# Altium schematic sheet QSFP.SchDoc: QSFP
size 420 x 297 mm; Author: G.K.; CompanyName: WUT; DrawnBy: G.K.; Organization: CERN; Address1: Warsaw Univeristy of Technology; Address2: Nowowiejska 15/19; DocumentNumber: 7; Revision: -; SheetNumber: 7; SheetTotal: -; EDA_Number: ARTIQ; Projet: RTM 4SFP 3QSFP; ModifiedBy: -; CreateDate: XX/XX/XXXX; CheckedDate: -; Title2: and I2C control; DivGrp: ISE; Designer: G.K.; ModifiedDate: -; ProjectName: RTM 4SFP 3QSFP
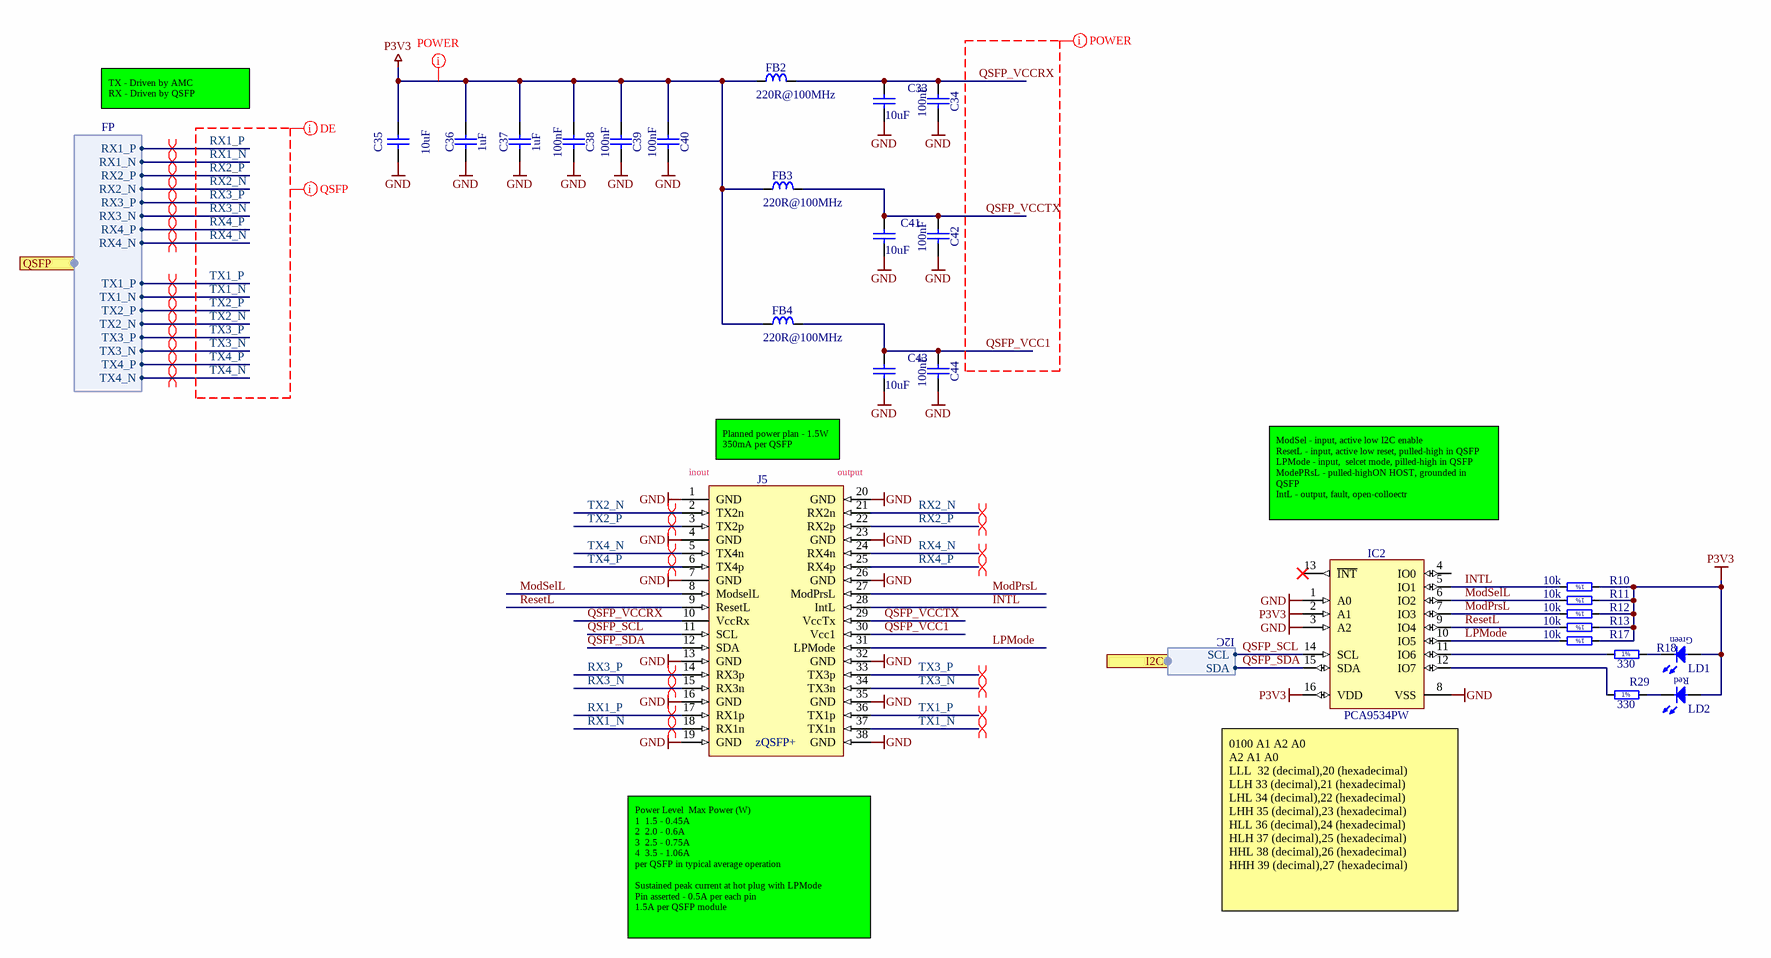
[diagram p0: QSFP.SchDoc]

## Parts
C33  10uF  [CAPC2012X135N]
C34  100nF  [CAPC0603X33N]
C35  10uF  [CAPC2012X135N]
C36  1uF  [CAPC1608X87N]
C37  1uF  [CAPC1608X87N]
C38  100nF  [CAPC0603X33N]
C39  100nF  [CAPC0603X33N]
C40  100nF  [CAPC0603X33N]
C41  10uF  [CAPC2012X135N]
C42  100nF  [CAPC0603X33N]
C43  10uF  [CAPC2012X135N]
C44  100nF  [CAPC0603X33N]
FB2  220R@100MHz  [INDC2012X105N]
FB3  220R@100MHz  [INDC2012X105N]
FB4  220R@100MHz  [INDC2012X105N]
IC2  PCA9534PW  [SOP65P640X110-16N]
J5  zQSFP+  [TYCO_1551920-2]
LD1  LED_AVAGO_HSME-C120  [LED_AVAGO_HSME-C120]  (value not drawn)
LD2  Red  [LED_AVAGO_HSME-C120rev]  (value not drawn)
R10  10k  [RESC1005X40N]
R11  10k  [RESC1005X40N]
R12  10k  [RESC1005X40N]
R13  10k  [RESC1005X40N]
R17  10k  [RESC1005X40N]
R18  330  [RESC1608X55N]
R29  330  [RESC1608X55N]

## Ports
I2C (harness I2C), QSFP (harness FP)

## Harnesses
FP: RX1_P, RX1_N, RX2_N, RX2_P, TX1_P, TX1_N, TX2_N, TX2_P, RX3_P, RX3_N, RX4_N, RX4_P, TX3_P, TX3_N, TX4_N, TX4_P
I2C: SCL, SDA

## Nets
GND: C33.2 C34.2 C35.2 C36.1 C37.1 C38.2 C39.2 C40.2 C41.2 C42.2 C43.2 C44.2 IC2.1(A0) IC2.3(A2) IC2.8(VSS) J5.1(GND) J5.4(GND) J5.7(GND) J5.13(GND) J5.16(GND) J5.19(GND) J5.20(GND) J5.23(GND) J5.26(GND) J5.32(GND) J5.35(GND) J5.38(GND)
P3V3: C35.1 C36.2 C37.2 C38.1 C39.1 C40.1 FB2.1 FB3.1 FB4.1 IC2.2(A1) IC2.16(VDD) LD1.2(A) LD2.1(A) R10.1 R11.1 R12.1 R13.1 R17.1
INTL: IC2.5(IO1) J5.28(IntL) R10.2
LPMode: IC2.10(IO5) J5.31(LPMode) R17.2
ModPrsL: IC2.7(IO3) J5.27(ModPrsL) R12.2
ModSelL: IC2.6(IO2) J5.8(ModselL) R11.2
QSFP_SCL: IC2.14(SCL) J5.11(SCL) ; port I2C.SCL
QSFP_SDA: IC2.15(SDA) J5.12(SDA) ; port I2C.SDA
QSFP_VCC1: C43.1 C44.1 FB4.2 J5.30(Vcc1)
QSFP_VCCRX: C33.1 C34.1 FB2.2 J5.10(VccRx)
QSFP_VCCTX: C41.1 C42.1 FB3.2 J5.29(VccTx)
ResetL: IC2.9(IO4) J5.9(ResetL) R13.2
RX1_N: J5.18(RX1n) ; port QSFP.RX1_N
RX1_P: J5.17(RX1p) ; port QSFP.RX1_P
RX2_N: J5.21(RX2n) ; port QSFP.RX2_N
RX2_P: J5.22(RX2p) ; port QSFP.RX2_P
RX3_N: J5.15(RX3n) ; port QSFP.RX3_N
RX3_P: J5.14(RX3p) ; port QSFP.RX3_P
RX4_N: J5.24(RX4n) ; port QSFP.RX4_N
RX4_P: J5.25(RX4p) ; port QSFP.RX4_P
TX1_N: J5.37(TX1n) ; port QSFP.TX1_N
TX1_P: J5.36(TX1p) ; port QSFP.TX1_P
TX2_N: J5.2(TX2n) ; port QSFP.TX2_N
TX2_P: J5.3(TX2p) ; port QSFP.TX2_P
TX3_N: J5.34(TX3n) ; port QSFP.TX3_N
TX3_P: J5.33(TX3p) ; port QSFP.TX3_P
TX4_N: J5.5(TX4n) ; port QSFP.TX4_N
TX4_P: J5.6(TX4p) ; port QSFP.TX4_P
NetIC2_11: IC2.11(IO6) R18.1
NetIC2_12: IC2.12(IO7) R29.1
NetLD1_1: LD1.1(C) R18.2
NetLD2_2: LD2.2(C) R29.2

Not connected (* = marked no-connect by the designer): IC2 4(IO0) 13(~{INT})*

## Layout directives
differential pair: RX1_N, RX1_P, RX2_N, RX2_P, RX3_N, RX3_P, RX4_N, RX4_P, TX1_N, TX1_P, TX2_N, TX2_P, TX3_N, TX3_P, TX4_N, TX4_P
net class POWER: P3V3, QSFP_VCC1, QSFP_VCCRX, QSFP_VCCTX
net class QSFP: RX1_N, RX1_P, RX2_N, RX2_P, RX3_N, RX3_P, RX4_N, RX4_P, TX1_N, TX1_P, TX2_N, TX2_P, TX3_N, TX3_P, TX4_N, TX4_P
net class DE: RX1_N, RX1_P, RX2_N, RX2_P, RX3_N, RX3_P, RX4_N, RX4_P, TX1_N, TX1_P, TX2_N, TX2_P, TX3_N, TX3_P, TX4_N, TX4_P

## Notes on the sheet
- TX - Driven by AMC
  RX - Driven by QSFP
- Planned power plan - 1.5W
  350mA per QSFP
- (near J5) inout
- (near J5) output
- ModSel - input, active low I2C enable
  ResetL - input, active low reset, pulled-high in QSFP
  LPMode - input,  selcet mode, pilled-high in QSFP
  ModePRsL - pulled-highON HOST, grounded in QSFP
  IntL - output, fault, open-colloectr
- (near IC2) 0100 A1 A2 A0
  A2 A1 A0
  LLL 	32 (decimal),20 (hexadecimal)
  LLH	33 (decimal),21 (hexadecimal)
  LHL	34 (decimal),22 (hexadecimal)
  LHH	35 (decimal),23 (hexadecimal)
  HLL	36 (decimal),24 (hexadecimal)
  HLH	37 (decimal),25 (hexadecimal)
  HHL	38 (decimal),26 (hexadecimal)
  HHH	39 (decimal),27 (hexadecimal)
- Power Level  Max Power (W)
  1  1.5 - 0.45A
  2  2.0 - 0.6A
  3  2.5 - 0.75A
  4  3.5 - 1.06A
  per QSFP in typical average operation
  Sustained peak current at hot plug with LPMode
  Pin asserted - 0.5A per each pin
  1.5A per QSFP module
- Project/Equipment
- Document
- Designer
- Drawn by
- Check.by
- Copyright WUT ISE 2018.
  This documentation describes Open Hardware and is licensed under the CERN OHL v.1.1. You may redistribute and modify this documentation under the terms of the CERN OHL v.1.1. (http://ohwr.org/CERNOHL). This documentation is distributed WITHOUT ANY EXPRESS OR IMPLIED WARRANTY, INCLUDING OF MERCHANTABILITY, SATISFACTORY QUALITY AND FITNESS FOR A PARTICULAR PURPOSE. Please see the CERN OHL v.1.1 for applicable conditions.
- Contact
- File
- Last Mod.
- Print Date
- Sheet
- Size
- A3
- of
- Rev
- (in symbol R0402_10K_1%_0.0625W_100PPM) 1%
- (in symbol R0603_330R_1%_0.1W_100PPM) 1%

## Library data of the parts
C33 C35 C41 C43 = CC0805_10UF_10V_10%_X7R: Non-polarised capacitor; Part Description: SMD Multilayer Chip Ceramic Capacitor; Manufacturer: GENERIC; Manufacturer1 Part Number: GRM21BR71A106KE51L; Voltage: 10V; TC: X7R; Tolerance: ±10%; Table: Capacitors SMD; Part Number: CC0805_10UF_10V_10%_X7R; Component Kind: Standard; Component Type: Standard; Pin Count: 2; Value: 10uF; Status: Preferred; Manufacturer Part Number: CC0805_10UF_10V_10%_X7R; Case: 0805; Mounted: Yes; Socket: No; SMD: Yes; Manufacturer1 Example: MURATA; Manufacturer1 ComponentHeight: 1.35mm; HelpURL: \\cern.ch\dfs\Applications\Altium\Datasheets\CC0805_X7R_MURATA.pdf; Author: CERN DEM JLC; CreateDate: 2012-04-30; LatestRevisionDate: 2012-04-30
C34 C38-C40 C42 C44 = CC0201_100NF_6.3V_10%_X5R: Non-polarised capacitor; Part Description: SMD Multilayer Chip Ceramic Capacitor; Manufacturer: GENERIC; Manufacturer1 Part Number: 02016D104KAT2A; Voltage: 6.3V; TC: X5R; Tolerance: ±10%; Table: Capacitors SMD; Part Number: CC0201_100NF_6.3V_10%_X5R; Component Kind: Standard; Component Type: Standard; Pin Count: 2; Value: 100nF; Status: Not Recommended; Manufacturer Part Number: CC0201_100NF_6.3V_10%_X5R; Case: 0201; Mounted: Yes; Socket: No; SMD: Yes; Manufacturer1 Example: AVX; Manufacturer1 ComponentHeight: 0.33mm; HelpURL: \\cern.ch\dfs\Applications\Altium\Datasheets\CC0201_X5R_AVX.pdf; Author: CERN DEM JLC; CreateDate: 2007-12-03; LatestRevisionDate: 2007-12-03
C36 C37 = CC0603_1UF_25V_10%_X7R: Non-polarised capacitor; Part Description: SMD Multilayer Chip Ceramic Capacitor; Manufacturer: GENERIC; Manufacturer1 Part Number: GRM188R71E105KA12D; Voltage: 25V; TC: X7R; Tolerance: ±10%; Table: Capacitors SMD; Part Number: CC0603_1UF_25V_10%_X7R; Component Kind: Standard; Component Type: Standard; Pin Count: 2; Value: 1uF; Status: None; Manufacturer Part Number: CC0603_1UF_25V_10%_X7R; Case: 0603; Mounted: Yes; Socket: No; SMD: Yes; Manufacturer1 Example: MURATA; Manufacturer1 ComponentHeight: 0.9mm; HelpURL: \\cern.ch\dfs\Applications\Altium\Datasheets\CC0603_X7R_MURATA.pdf; Author: CERN DEM JLC; CreateDate: 2011-01-18; LatestRevisionDate: 2011-01-18
FB2-FB4 = IND0805_MURATA_BLM21PG221SN1D: Inductor; Part Description: SMD EMIFIL Suppression Chip Ferrite Bead; Manufacturer: MURATA; Power: 2A; Resistance: 0.05R; Tolerance: ±25%; Table: Inductors SMD; Part Number: IND0805_MURATA_BLM21PG221SN1D; Component Kind: Standard; Component Type: Standard; Pin Count: 2; Value: 220R@100MHz; Status: None; Manufacturer Part Number: BLM21PG221SN1D; Case: 0805; Mounted: Yes; Socket: No; SMD: Yes; ComponentHeight: 1.05mm; HelpURL: \\cern.ch\dfs\Applications\Altium\Datasheets\IND0402_MURATA_BLM21P.pdf; Author: CERN DEM JLC; CreateDate: 2010-01-25; LatestRevisionDate: 2010-01-25
IC2 = PCA9534PW: 8-Bit I2C-Bus and SMBus Low Power I/O Port with Interrupt; Manufacturer: ANALOG DEVICES; PressFit: No; Bonding: No; Table: Analog & Interface; Part Number: PCA9534PW; Component Kind: Standard; Component Type: Standard; Device: PCA9534PW; PackageDescription: SOP, 0.65mm pitch; 16 pin, 4.40mm W X 5.00mm L X 1.10mm H body IPC Medium Density; Part Description: 8-Bit I2C-Bus and SMBus Low Power I/O Port with Interrupt; Manufacturer Part Number: PCA9534PW; Pin Count: 16; Case: SSOP16; Mounted: Yes; Socket: No; SMD: Yes; ComponentHeight: 1.1mm; Author: CERN DEM JLC; HelpURL: \\cern.ch\dfs\Applications\Altium\Datasheets\PCA9534PW.pdf; CreateDate: 2013-12-18; LatestRevisionDate: 2013-12-18
J5 = TYCO_1551920-2: 38Position QSFP Connector  (Quad Small Form-factor Pluggable); Part Description: 38 Positions, Pitch 0.8mm zSFP+ Receptacle (Small Form-factor Pluggable); Manufacturer: TYCO ELECTRONICS; PressFit: No; Part Number: TYCO_1551920-2; Component Kind: Standard; Component Type: Standard; Pin Count: 38; Family: zQSFP+; Mounted: Yes; Socket: No; SMD: No; Sense: No; Status: None; Manufacturer Part Number: 1551920-2; ComponentHeight: 6.1mm; HelpURL: \\cern.ch\dfs\Applications\Altium\Datasheets\TYCO_1551920-2.pdf; Author: CERN DEM JLC; CreateDate: 24.05.2018; LatestRevisionDate: 24.05.2018
LD1 = LED_AVAGO_HSME-C120: LED Green 1C 2A; Part Description: High Performance Right Angle Chip Green LED; Manufacturer: AVAGO TECHNOLOGIES; Table: LEDs & Displays; Part Number: LED_AVAGO_HSME-C120; Component Kind: Standard; Component Type: Standard; Color: Green; PackageDescription: Green Chip LED, 2-Leads, Body 1.7x1.1mm, Side Emitting Package; Manufacturer Part Number: HSME-C120; Pin Count: 2; Mounted: Yes; Socket: No; SMD: Yes; ComponentHeight: 0.7mm; HelpURL: \\cern.ch\dfs\Applications\Altium\Datasheets\LED_AVAGO_HSME-C120.pdf; ComponentLink1URL: \\cern.ch\dfs\Applications\Altium\Datasheets\LED_AVAGO_HSME-C110_DESIGN-GUIDE.pdf; ComponentLink1Description: Design Guide; Author: CERN DEM JMW; CreateDate: 2009-07-22; LatestRevisionDate: 2012-06-20
LD2 = LED_SMD_90deg_mini_R: LED Red Avago C120; Part Number: LED_AVAGO_HSMC-C120; Part Description: High Performance Right Angle Chip Red LED; Manufacturer: AVAGO TECHNOLOGIES; Manufacturer Part Number: HSMC-C120; Table: LEDs & Displays; Component Kind: Standard; Component Type: Standard; Color: Red; Footprint: LED_AVAGO_HSMC-C120; PackageDescription: Red Chip LED, 2-Leads, Body 1.7x1.1mm, Side Emitting Package; Pin Count: 2; Mounted: Yes; Socket: No; SMD: Yes; ComponentHeight: 0.7mm; HelpURL: \\cern.ch\dfs\Applications\Altium\Datasheets\LED_AVAGO_HSME-C120.pdf; ComponentLink1URL: \\cern.ch\dfs\Applications\Altium\Datasheets\LED_AVAGO_HSME-C110_DESIGN-GUIDE.pdf; ComponentLink1Description: Design Guide; Author: CERN DEM JMW; CreateDate: 2009-07-22; LatestRevisionDate: 2012-06-20
R10-R13 R17 = R0402_10K_1%_0.0625W_100PPM: Resistor - 1%; Part Description: General Purpose Thick Film Chip Resistor; Manufacturer: GENERIC; Manufacturer1 Part Number: 232270671003L; TC: ±100ppm/°C; Table: Resistors SMD; Part Number: R0402_10K_1%_0.0625W_100PPM; Component Kind: Standard; Component Type: Standard; Pin Count: 2; Value: 10k; Status: Not recommended; Power: 0.0625W; Tolerance: ±1%; Manufacturer Part Number: R0402_10K_1%_0.0625W_100PPM; Case: 0402; Mounted: Yes; Socket: No; SMD: Yes; Manufacturer1 Example: YAGEO PHYCOMP; Manufacturer1 ComponentHeight: 0.4mm; HelpURL: \\cern.ch\dfs\Applications\Altium\Datasheets\R0402_Phycomp_RC0402.pdf; Author: CERN DEM JLC; CreateDate: 2007-12-03; LatestRevisionDate: 2012-10-17
R18 R29 = R0603_330R_1%_0.1W_100PPM: Resistor - 1%; Part Description: General Purpose Thick Film Chip Resistor; Manufacturer: GENERIC; Manufacturer1 Part Number: NRC06F3300TRF; Power: 0.1W; TC: ±100ppm/°C; Table: Resistors SMD; Part Number: R0603_330R_1%_0.1W_100PPM; Component Kind: Standard; Component Type: Standard; Pin Count: 2; Value: 330; Status: Preferred; Tolerance: ±1%; Manufacturer Part Number: R0603_330R_1%_0.1W_100PPM; Case: 0603; Mounted: Yes; Socket: No; SMD: Yes; Manufacturer1 Example: NIC COMPONENT; Manufacturer1 ComponentHeight: 0.55mm; HelpURL: \\cern.ch\dfs\Applications\Altium\Datasheets\R0603_NIC_NRC.pdf; Author: CERN DEM JLC; CreateDate: 2007-12-03; LatestRevisionDate: 2008-03-13